# Altium project FlexiGlow_Rev_A.PrjPcb
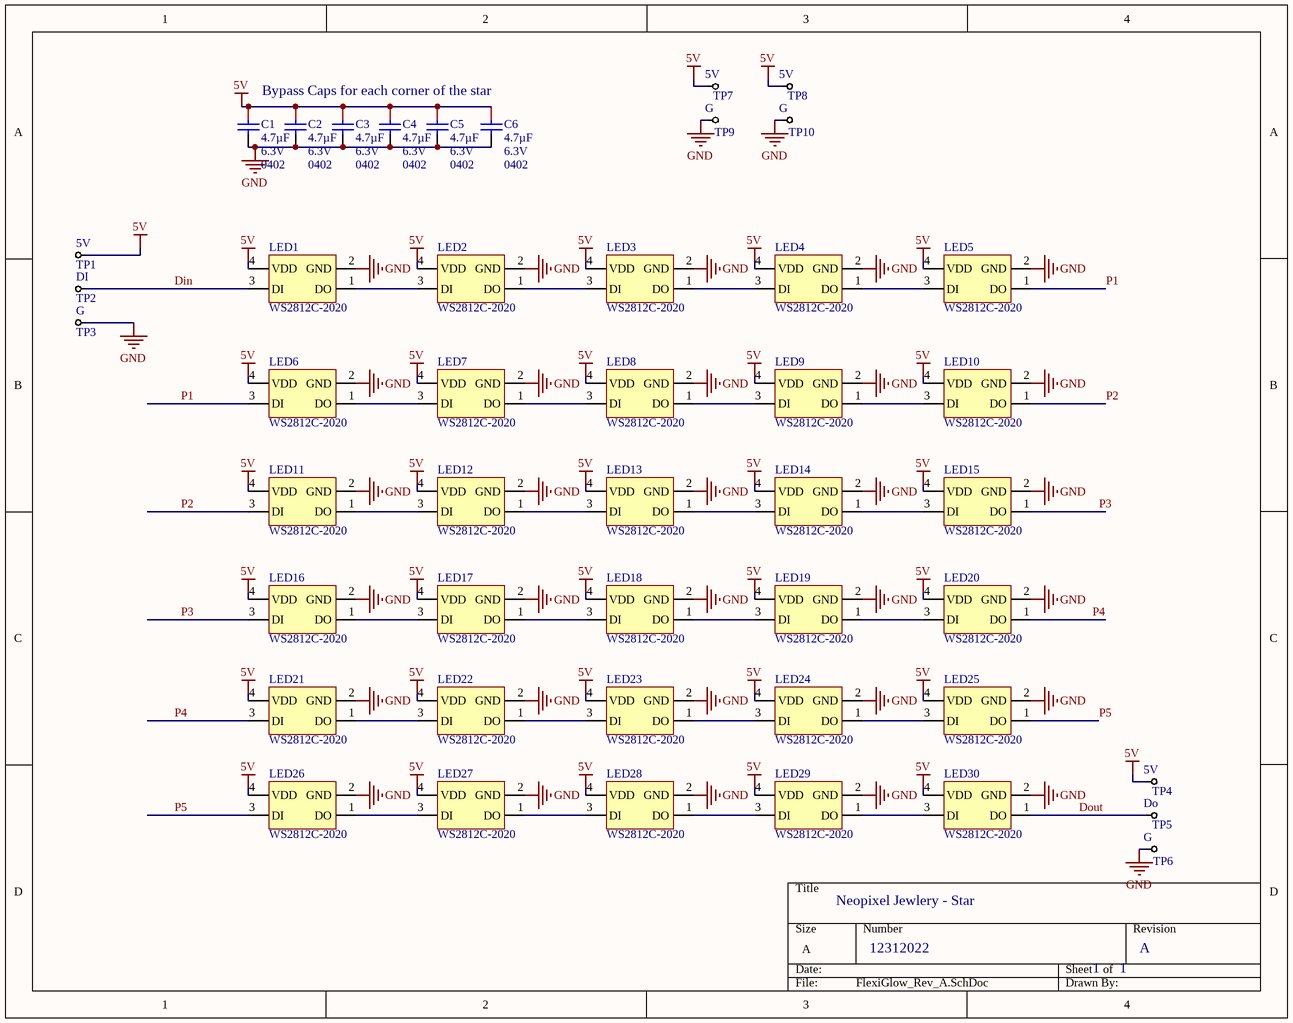
[diagram p0: FlexiGlow_Rev_A.SchDoc]
Rev: A
1 sheet, 46 parts. Net scope: global (net labels, ports and power ports of the same name join across sheets).
Board file: FlexiGlow_Rev_A.PcbDoc

## Sheet FlexiGlow_Rev_A.SchDoc
size A; SheetNumber: 1; SheetTotal: 1

### Parts
C1  Capacitance: 4.7µF  Voltage - Rated: 6.3V  Package / Case: 0402  [CAPC0402(1005)_N]  (hidden comment: 4.7uF)
C2  Capacitance: 4.7µF  Voltage - Rated: 6.3V  Package / Case: 0402  [CAPC0402(1005)_N]  (hidden comment: 4.7uF)
C3  Capacitance: 4.7µF  Voltage - Rated: 6.3V  Package / Case: 0402  [CAPC0402(1005)_N]  (hidden comment: 4.7uF)
C4  Capacitance: 4.7µF  Voltage - Rated: 6.3V  Package / Case: 0402  [CAPC0402(1005)_N]  (hidden comment: 4.7uF)
C5  Capacitance: 4.7µF  Voltage - Rated: 6.3V  Package / Case: 0402  [CAPC0402(1005)_N]  (hidden comment: 4.7uF)
C6  Capacitance: 4.7µF  Voltage - Rated: 6.3V  Package / Case: 0402  [CAPC0402(1005)_N]  (hidden comment: 4.7uF)
LED1  WS2812C-2020  [WS2812C-2020]
LED2  WS2812C-2020  [WS2812C-2020]
LED3  WS2812C-2020  [WS2812C-2020]
LED4  WS2812C-2020  [WS2812C-2020]
LED5  WS2812C-2020  [WS2812C-2020]
LED6  WS2812C-2020  [WS2812C-2020]
LED7  WS2812C-2020  [WS2812C-2020]
LED8  WS2812C-2020  [WS2812C-2020]
LED9  WS2812C-2020  [WS2812C-2020]
LED10  WS2812C-2020  [WS2812C-2020]
LED11  WS2812C-2020  [WS2812C-2020]
LED12  WS2812C-2020  [WS2812C-2020]
LED13  WS2812C-2020  [WS2812C-2020]
LED14  WS2812C-2020  [WS2812C-2020]
LED15  WS2812C-2020  [WS2812C-2020]
LED16  WS2812C-2020  [WS2812C-2020]
LED17  WS2812C-2020  [WS2812C-2020]
LED18  WS2812C-2020  [WS2812C-2020]
LED19  WS2812C-2020  [WS2812C-2020]
LED20  WS2812C-2020  [WS2812C-2020]
LED21  WS2812C-2020  [WS2812C-2020]
LED22  WS2812C-2020  [WS2812C-2020]
LED23  WS2812C-2020  [WS2812C-2020]
LED24  WS2812C-2020  [WS2812C-2020]
LED25  WS2812C-2020  [WS2812C-2020]
LED26  WS2812C-2020  [WS2812C-2020]
LED27  WS2812C-2020  [WS2812C-2020]
LED28  WS2812C-2020  [WS2812C-2020]
LED29  WS2812C-2020  [WS2812C-2020]
LED30  WS2812C-2020  [WS2812C-2020]
TP1  5V  [TestPoint-Micro]  (no BOM)
TP2  DI  [TestPoint-Micro]  (no BOM)
TP3  G  [TestPoint-Micro]  (no BOM)
TP4  5V  [TestPoint-Micro]  (no BOM)
TP5  Do  [TestPoint-Micro]  (no BOM)
TP6  G  [TestPoint-Micro]  (no BOM)
TP7  5V  [TestPoint-Micro]  (no BOM)
TP8  5V  [TestPoint-Micro]  (no BOM)
TP9  G  [TestPoint-Micro]  (no BOM)
TP10  G  [TestPoint-Micro]  (no BOM)

### Nets
5V: C1.1 C2.1 C3.1 C4.1 C5.1 C6.1 LED1.4(VDD) LED2.4(VDD) LED3.4(VDD) LED4.4(VDD) LED5.4(VDD) LED6.4(VDD) LED7.4(VDD) LED8.4(VDD) LED9.4(VDD) LED10.4(VDD) LED11.4(VDD) LED12.4(VDD) LED13.4(VDD) LED14.4(VDD) LED15.4(VDD) LED16.4(VDD) LED17.4(VDD) LED18.4(VDD) LED19.4(VDD) LED20.4(VDD) LED21.4(VDD) LED22.4(VDD) LED23.4(VDD) LED24.4(VDD) LED25.4(VDD) LED26.4(VDD) LED27.4(VDD) LED28.4(VDD) LED29.4(VDD) LED30.4(VDD) TP1.1 TP4.1 TP7.1 TP8.1
GND: C1.2 C2.2 C3.2 C4.2 C5.2 C6.2 LED1.2(GND) LED2.2(GND) LED3.2(GND) LED4.2(GND) LED5.2(GND) LED6.2(GND) LED7.2(GND) LED8.2(GND) LED9.2(GND) LED10.2(GND) LED11.2(GND) LED12.2(GND) LED13.2(GND) LED14.2(GND) LED15.2(GND) LED16.2(GND) LED17.2(GND) LED18.2(GND) LED19.2(GND) LED20.2(GND) LED21.2(GND) LED22.2(GND) LED23.2(GND) LED24.2(GND) LED25.2(GND) LED26.2(GND) LED27.2(GND) LED28.2(GND) LED29.2(GND) LED30.2(GND) TP3.1 TP6.1 TP9.1 TP10.1
Din: LED1.3(DI) TP2.1
Dout: LED30.1(DO) TP5.1
P1: LED5.1(DO) LED6.3(DI)
P2: LED10.1(DO) LED11.3(DI)
P3: LED15.1(DO) LED16.3(DI)
P4: LED20.1(DO) LED21.3(DI)
P5: LED25.1(DO) LED26.3(DI)
NetLED1_1: LED1.1(DO) LED2.3(DI)
NetLED2_1: LED2.1(DO) LED3.3(DI)
NetLED3_1: LED3.1(DO) LED4.3(DI)
NetLED4_1: LED4.1(DO) LED5.3(DI)
NetLED6_1: LED6.1(DO) LED7.3(DI)
NetLED7_1: LED7.1(DO) LED8.3(DI)
NetLED8_1: LED8.1(DO) LED9.3(DI)
NetLED9_1: LED9.1(DO) LED10.3(DI)
NetLED11_1: LED11.1(DO) LED12.3(DI)
NetLED12_1: LED12.1(DO) LED13.3(DI)
NetLED13_1: LED13.1(DO) LED14.3(DI)
NetLED14_1: LED14.1(DO) LED15.3(DI)
NetLED16_1: LED16.1(DO) LED17.3(DI)
NetLED17_1: LED17.1(DO) LED18.3(DI)
NetLED18_1: LED18.1(DO) LED19.3(DI)
NetLED19_1: LED19.1(DO) LED20.3(DI)
NetLED21_1: LED21.1(DO) LED22.3(DI)
NetLED22_1: LED22.1(DO) LED23.3(DI)
NetLED23_1: LED23.1(DO) LED24.3(DI)
NetLED24_1: LED24.1(DO) LED25.3(DI)
NetLED26_1: LED26.1(DO) LED27.3(DI)
NetLED27_1: LED27.1(DO) LED28.3(DI)
NetLED28_1: LED28.1(DO) LED29.3(DI)
NetLED29_1: LED29.1(DO) LED30.3(DI)

### Notes on the sheet
- Bypass Caps for each corner of the star
- Neopixel Jewlery - Star
- 12312022
- 1
- A

### Library data of the parts
C1-C6 = CAP CER 4.7UF 6.3V 10% X5R 0402: 4.7uF 0402; Manufacturer: Murata Electronics North America; Manufacturer Part Number: GRM155R60J475ME47D; Tolerance: ±20%; Temperature Coefficient: X5R; Supplier 1: Digi-Key; RoHS: RoHS Compliant; Category: Capacitors; Stock 1: 162576; Pricing 1: 1=0.15, 10=0.1, 50=0.0576, 100=0.0475, 250=0.04, 500=0.0335, 1000=0.0275, 5000=0.02325 (USD); Packaging: Cut Tape (CT); Mounting Type: Surface Mount, MLCC; Operating Temperature: -55°C ~ 85°C; Applications: General Purpose; Ratings: -; Size / Dimension: 0.039" L x 0.020" W (1.00mm x 0.50mm); Height - Seated (Max): -; Thickness (Max): 0.024" (0.60mm); Lead Spacing: -; Features: -; Lead Style: -; ComponentLink1URL: http://www.murata.com/~/media/webrenewal/support/library/catalog/products/capacitor/mlcc/c02e.ashx; ComponentLink1Description: http://www.murata.com/~/media/webrenewal/support/library/catalog/products/capacitor/mlcc/c02e.ashx; Supplier Part Number 1: 490-5915-1-ND
LED1-LED30 = WS2812C-2020: Neopixel
TP1-TP10 = TestPoint, small: Test Point